# Altium project PCB_Project1.PrjPCB
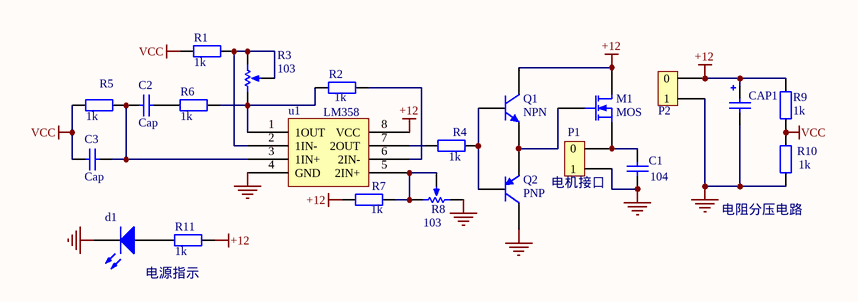
[diagram p0: Sheet1.SchDoc]
1 sheet, 22 parts. Net scope: global (net labels, ports and power ports of the same name join across sheets).
Board file: PCB1.PcbDoc

## Sheet Sheet1.SchDoc
size A4

### Parts
C1  104  [C]
C2  Cap  [Cap]
C3  Cap  [Cap]
CAP1  电解小电容  [电解小电容]  (value not drawn)
d1  LED  [LED]  (value not drawn)
M1  MOS  [MOS1]
P1  双孔压线器  [双孔压线器]  (value not drawn)
P2  双孔压线器  [双孔压线器]  (value not drawn)
Q1  NPN  [npn - duplicate]
Q2  PNP  [pnp - duplicate]
R1  电阻  [电阻]  (value not drawn)
R2  电阻  [电阻]  (value not drawn)
R3  滑动变阻器  [滑动变阻器]  (value not drawn)
R4  电阻  [电阻]  (value not drawn)
R5  电阻  [电阻]  (value not drawn)
R6  电阻  [电阻]  (value not drawn)
R7  电阻  [电阻]  (value not drawn)
R8  滑动变阻器  [滑动变阻器]  (value not drawn)
R9  电阻  [电阻]  (value not drawn)
R10  电阻  [电阻]  (value not drawn)
R11  电阻  [电阻]  (value not drawn)
u1  LM358  [LM358]

### Nets
+12: CAP1.2 M1.1(D) P2.0 Q1.1(C) R7.1 R9.2 R11.2 u1.8(VCC)
GND: C1.1 CAP1.1 d1.2(K) P1.1 P2.1 Q2.1(C) R8.1(TOP) R10.1 u1.4(GND)
VCC: C3.2 R1.1 R5.2 R9.1 R10.2
NetC1_2: C1.2 M1.3(S) P1.0
NetC2_1: C2.1 C3.1 R5.1 u1.3(1IN+)
NetC2_2: C2.2 R6.1
Netd1_1: d1.1(A) R11.1
NetM1_2: M1.2(G) Q1.3(E) Q2.3(E)
NetQ1_2: Q1.2(B) Q2.2(B) R4.2
NetR1_2: R1.2 R3.2(BOT) R3.3(TAP) u1.2(1IN-)
NetR2_1: R2.1 R3.1(TOP) R6.2 u1.1(1OUT)
NetR2_2: R2.2 u1.6(2IN-)
NetR4_1: R4.1 u1.7(2OUT)
NetR7_2: R7.2 R8.2(BOT) R8.3(TAP) u1.5(2IN+)

### Notes on the sheet
- (near P1) 电机接口
- (near R10) 电阻分压电路
- 电源指示
- (in symbol 滑动变阻器) 103
- (in symbol 电阻) 1k

### Library data of the parts
C1 = Cap